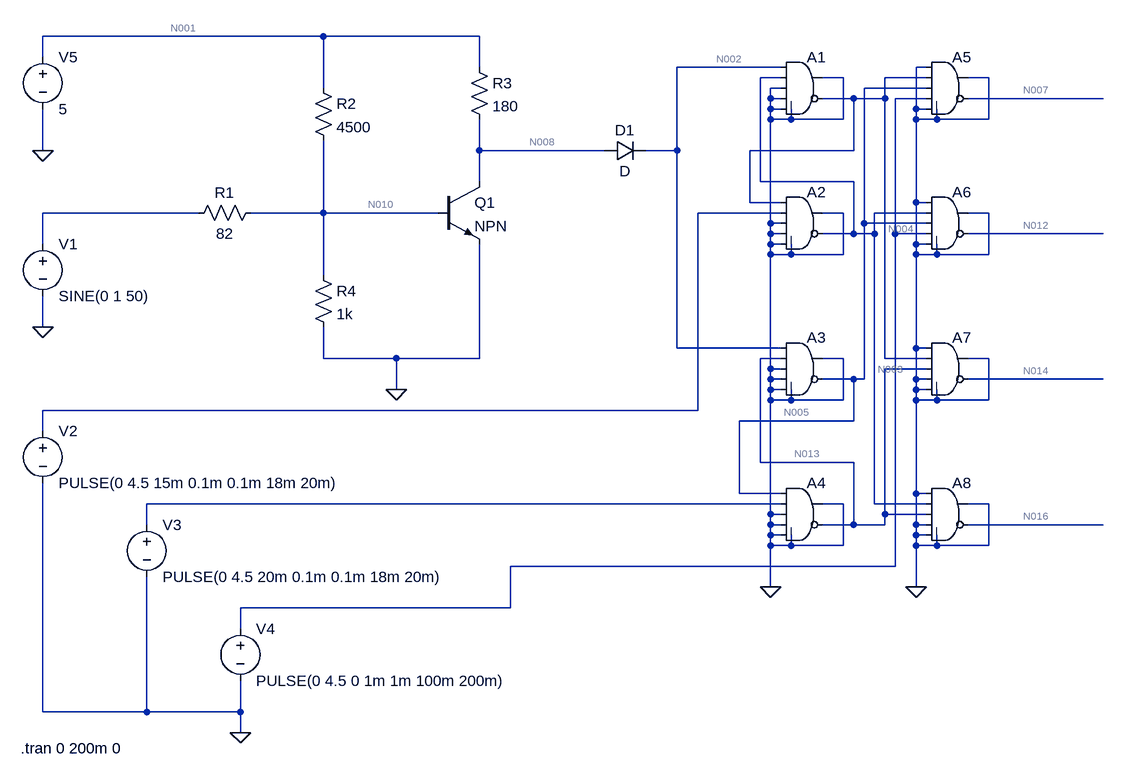
[diagram p0: schematic Draft2.asc]
Draft2.asc, the LTspice schematic file:
Version 4
SHEET 1 1300 744
WIRE 96 -368 -336 -368
WIRE 336 -368 96 -368
WIRE -336 -336 -336 -368
WIRE 336 -320 336 -368
WIRE 800 -320 640 -320
WIRE 1024 -320 1008 -320
WIRE 800 -304 768 -304
WIRE 896 -304 864 -304
WIRE 1024 -304 960 -304
WIRE 1120 -304 1088 -304
WIRE 96 -288 96 -368
WIRE 800 -288 784 -288
WIRE 1024 -288 928 -288
WIRE 784 -272 784 -288
WIRE 800 -272 784 -272
WIRE 912 -272 864 -272
WIRE 960 -272 960 -304
WIRE 960 -272 912 -272
WIRE 1024 -272 976 -272
WIRE 1296 -272 1088 -272
WIRE 784 -256 784 -272
WIRE 800 -256 784 -256
WIRE 1008 -256 1008 -320
WIRE 1024 -256 1008 -256
WIRE 784 -240 784 -256
WIRE 816 -240 816 -256
WIRE 816 -240 784 -240
WIRE 896 -240 896 -304
WIRE 896 -240 816 -240
WIRE 1008 -240 1008 -256
WIRE 1040 -240 1040 -256
WIRE 1040 -240 1008 -240
WIRE 1120 -240 1120 -304
WIRE 1120 -240 1040 -240
WIRE -336 -192 -336 -256
WIRE 336 -192 336 -240
WIRE 528 -192 336 -192
WIRE 640 -192 640 -320
WIRE 640 -192 592 -192
WIRE 912 -192 912 -272
WIRE 912 -192 752 -192
WIRE 336 -144 336 -192
WIRE 768 -144 768 -304
WIRE 912 -144 768 -144
WIRE 752 -112 752 -192
WIRE 800 -112 752 -112
WIRE 1008 -112 1008 -240
WIRE 1024 -112 1008 -112
WIRE -96 -96 -336 -96
WIRE 96 -96 96 -208
WIRE 96 -96 -16 -96
WIRE 272 -96 96 -96
WIRE 800 -96 672 -96
WIRE 896 -96 864 -96
WIRE 1024 -96 944 -96
WIRE 1120 -96 1088 -96
WIRE 784 -80 784 -240
WIRE 800 -80 784 -80
WIRE 928 -80 928 -288
WIRE 1024 -80 928 -80
WIRE 784 -64 784 -80
WIRE 800 -64 784 -64
WIRE 912 -64 912 -144
WIRE 912 -64 864 -64
WIRE 944 -64 944 -96
WIRE 944 -64 912 -64
WIRE 976 -64 976 -272
WIRE 1024 -64 976 -64
WIRE 1296 -64 1088 -64
WIRE -336 -48 -336 -96
WIRE 784 -48 784 -64
WIRE 800 -48 784 -48
WIRE 1008 -48 1008 -112
WIRE 1024 -48 1008 -48
WIRE 784 -32 784 -48
WIRE 816 -32 816 -48
WIRE 816 -32 784 -32
WIRE 896 -32 896 -96
WIRE 896 -32 816 -32
WIRE 1008 -32 1008 -48
WIRE 1040 -32 1040 -48
WIRE 1040 -32 1008 -32
WIRE 1120 -32 1120 -96
WIRE 1120 -32 1040 -32
WIRE 96 0 96 -96
WIRE -336 80 -336 32
WIRE 640 112 640 -192
WIRE 800 112 640 112
WIRE 1008 112 1008 -32
WIRE 1024 112 1008 112
WIRE 96 128 96 80
WIRE 208 128 96 128
WIRE 336 128 336 -48
WIRE 336 128 208 128
WIRE 800 128 768 128
WIRE 896 128 864 128
WIRE 960 128 960 -272
WIRE 1024 128 960 128
WIRE 1120 128 1088 128
WIRE 784 144 784 -32
WIRE 800 144 784 144
WIRE 1024 144 960 144
WIRE 784 160 784 144
WIRE 800 160 784 160
WIRE 912 160 864 160
WIRE 928 160 928 -80
WIRE 928 160 912 160
WIRE 1008 160 1008 112
WIRE 1024 160 1008 160
WIRE 1296 160 1088 160
WIRE 208 176 208 128
WIRE 784 176 784 160
WIRE 800 176 784 176
WIRE 1008 176 1008 160
WIRE 1024 176 1008 176
WIRE 784 192 784 176
WIRE 816 192 816 176
WIRE 816 192 784 192
WIRE 896 192 896 128
WIRE 896 192 816 192
WIRE 1008 192 1008 176
WIRE 1040 192 1040 176
WIRE 1040 192 1008 192
WIRE 1120 192 1120 128
WIRE 1120 192 1040 192
WIRE 672 208 672 -96
WIRE 672 208 -336 208
WIRE 912 224 912 160
WIRE 912 224 736 224
WIRE -336 240 -336 208
WIRE 768 288 768 128
WIRE 912 288 768 288
WIRE 736 336 736 224
WIRE 800 336 736 336
WIRE 1008 336 1008 192
WIRE 1024 336 1008 336
WIRE 800 352 -176 352
WIRE 896 352 864 352
WIRE 944 352 944 -64
WIRE 1024 352 944 352
WIRE 1120 352 1088 352
WIRE 784 368 784 192
WIRE 800 368 784 368
WIRE 960 368 960 144
WIRE 1024 368 960 368
WIRE -176 384 -176 352
WIRE 784 384 784 368
WIRE 800 384 784 384
WIRE 912 384 912 288
WIRE 912 384 864 384
WIRE 960 384 960 368
WIRE 960 384 912 384
WIRE 1008 384 1008 336
WIRE 1024 384 1008 384
WIRE 1296 384 1088 384
WIRE 784 400 784 384
WIRE 800 400 784 400
WIRE 1008 400 1008 384
WIRE 1024 400 1008 400
WIRE 784 416 784 400
WIRE 816 416 816 400
WIRE 816 416 784 416
WIRE 896 416 896 352
WIRE 896 416 816 416
WIRE 1008 416 1008 400
WIRE 1040 416 1040 400
WIRE 1040 416 1008 416
WIRE 1120 416 1120 352
WIRE 1120 416 1040 416
WIRE 976 448 976 -64
WIRE 976 448 384 448
WIRE 784 480 784 416
WIRE 1008 480 1008 416
WIRE 384 512 384 448
WIRE 384 512 -32 512
WIRE -32 544 -32 512
WIRE -336 672 -336 320
WIRE -176 672 -176 464
WIRE -176 672 -336 672
WIRE -32 672 -32 624
WIRE -32 672 -176 672
WIRE -32 704 -32 672
FLAG 208 176 0
FLAG -32 704 0
FLAG -336 80 0
FLAG -336 -192 0
FLAG 784 480 0
FLAG 1008 480 0
SYMBOL voltage -336 -64 R0
WINDOW 123 0 0 Left 2
WINDOW 39 0 0 Left 2
SYMATTR InstName V1
SYMATTR Value SINE(0 1 50)
SYMBOL voltage -336 224 R0
WINDOW 123 0 0 Left 2
WINDOW 39 0 0 Left 2
SYMATTR InstName V2
SYMATTR Value PULSE(0 4.5 15m 0.1m 0.1m 18m 20m)
SYMBOL voltage -176 368 R0
WINDOW 123 0 0 Left 2
WINDOW 39 0 0 Left 2
SYMATTR InstName V3
SYMATTR Value PULSE(0 4.5 20m 0.1m 0.1m 18m 20m)
SYMBOL res -112 -80 R270
WINDOW 0 32 56 VTop 2
WINDOW 3 0 56 VBottom 2
SYMATTR InstName R1
SYMATTR Value 82
SYMATTR SpiceLine tol=5 pwr=0.25
SYMBOL res 80 -304 R0
SYMATTR InstName R2
SYMATTR Value 4500
SYMATTR SpiceLine tol=5 pwr=0.25
SYMBOL res 320 -336 R0
SYMATTR InstName R3
SYMATTR Value 180
SYMATTR SpiceLine tol=5 pwr=0.25
SYMBOL res 80 -16 R0
SYMATTR InstName R4
SYMATTR Value 1k
SYMATTR SpiceLine tol=5 pwr=0.25
SYMBOL npn 272 -144 R0
SYMATTR InstName Q1
SYMBOL diode 528 -176 R270
WINDOW 0 32 32 VTop 2
WINDOW 3 0 32 VBottom 2
SYMATTR InstName D1
SYMBOL voltage -32 528 R0
WINDOW 123 0 0 Left 2
WINDOW 39 0 0 Left 2
SYMATTR InstName V4
SYMATTR Value PULSE(0 4.5 0 1m 1m 100m 200m)
SYMBOL Digital\\and 832 -144 R0
WINDOW 3 16 112 Invisible 2
SYMATTR InstName A2
SYMATTR Value Vhigh=4.5 Vlow=0.5
SYMBOL Digital\\and 832 -352 R0
WINDOW 3 16 112 Invisible 2
SYMATTR InstName A1
SYMATTR Value Vhigh=4.5 Vlow=0.5
SYMBOL Digital\\and 832 80 R0
WINDOW 3 16 112 Invisible 2
SYMATTR InstName A3
SYMATTR Value Vhigh=4.5 Vlow=0.5
SYMBOL Digital\\and 832 304 R0
WINDOW 3 16 112 Invisible 2
SYMATTR InstName A4
SYMATTR Value Vhigh=4.5 Vlow=0.5
SYMBOL Digital\\and 1056 -352 R0
WINDOW 3 16 112 Invisible 2
SYMATTR InstName A5
SYMATTR Value Vhigh=4.5 Vlow=0.5
SYMBOL Digital\\and 1056 -144 R0
WINDOW 3 16 112 Invisible 2
SYMATTR InstName A6
SYMATTR Value Vhigh=4.5 Vlow=0.5
SYMBOL Digital\\and 1056 80 R0
WINDOW 3 16 112 Invisible 2
SYMATTR InstName A7
SYMATTR Value Vhigh=4.5 Vlow=0.5
SYMBOL Digital\\and 1056 304 R0
WINDOW 3 16 112 Invisible 2
SYMATTR InstName A8
SYMATTR Value Vhigh=4.5 Vlow=0.5
SYMBOL voltage -336 -352 R0
WINDOW 123 0 0 Left 2
WINDOW 39 0 0 Left 2
SYMATTR InstName V5
SYMATTR Value 5
TEXT -370 728 Left 2 !.tran 0 200m 0

The netlist it stands for:
* Draft2.asc
V1 N009 0 SINE(0 1 50)
V2 N011 0 PULSE(0 4.5 15m 0.1m 0.1m 18m 20m)
V3 N015 0 PULSE(0 4.5 20m 0.1m 0.1m 18m 20m)
R1 N009 N010 82 tol=5 pwr=0.25
R2 N001 N010 4500 tol=5 pwr=0.25
R3 N001 N008 180 tol=5 pwr=0.25
R4 N010 0 1k tol=5 pwr=0.25
Q1 N008 N010 0 0 NPN
D1 N008 N002 D
V4 N006 0 PULSE(0 4.5 0 1m 1m 100m 200m)
A2 N004 N011 0 0 0 N003 0 0 AND Vhigh=4.5 Vlow=0.5
A1 N002 N003 0 0 0 N004 0 0 AND Vhigh=4.5 Vlow=0.5
A3 N002 N013 0 0 0 N005 0 0 AND Vhigh=4.5 Vlow=0.5
A4 N005 N015 0 0 0 N013 0 0 AND Vhigh=4.5 Vlow=0.5
A5 0 N004 N005 N006 0 N007 0 0 AND Vhigh=4.5 Vlow=0.5
A6 0 N003 N005 N006 0 N012 0 0 AND Vhigh=4.5 Vlow=0.5
A7 0 N004 N013 0 0 N014 0 0 AND Vhigh=4.5 Vlow=0.5
A8 0 N003 N013 0 0 N016 0 0 AND Vhigh=4.5 Vlow=0.5
V5 N001 0 5
.model D D
.lib standard.dio
.model NPN NPN
.model PNP PNP
.lib standard.bjt
.tran 0 200m 0
.backanno
.end

* Results of the author's LTspice run, read from the files saved beside the schematic
* Operating Point, zero values left out:
*   V(n010) = 82.81 mV
*   V(n001) = 5 V
*   V(n008) = 5 V
*   V(n002) = 5 V
*   V(n004) = 500 mV
*   V(n003) = 4.5 V
*   V(n013) = 4.5 V
*   V(n005) = 500 mV
*   V(n007) = 4.5 V
*   V(n012) = 4.5 V
*   V(n014) = 4.5 V
*   V(n016) = 500 mV
*   Ic(Q1) = 4.92 pA
*   Ib(Q1) = -4.834 pA
*   I(R4) = 82.81 µA
*   I(R3) = 4.92 pA
*   I(R2) = 1.093 mA
*   I(R1) = -1.01 mA
*   I(V5) = -1.093 mA
*   I(V1) = 1.01 mA
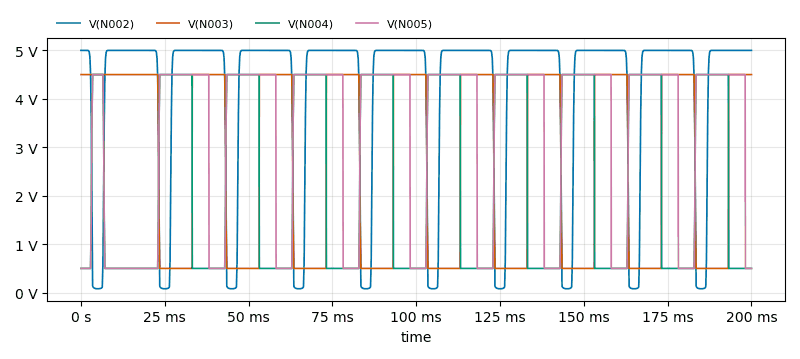
[diagram p1: Transient Analysis of Draft2.asc, plotted from the saved traces]
* Transient Analysis, 1 run:
*   V(N002): min 79 mV, max 5 V, average 4.098 V, rms 4.484 V, last 5 V
*   V(N003): min 500 mV, max 4.5 V, average 2.705 V, rms 3.349 V, last 4.5 V
*   V(N004): min 500 mV, max 4.5 V, average 2.369 V, rms 3.086 V, last 500 mV
*   V(N005): min 500 mV, max 4.5 V, average 3.27 V, rms 3.745 V, last 500 mV